# Altium schematic sheet connector.SchDoc
size A4
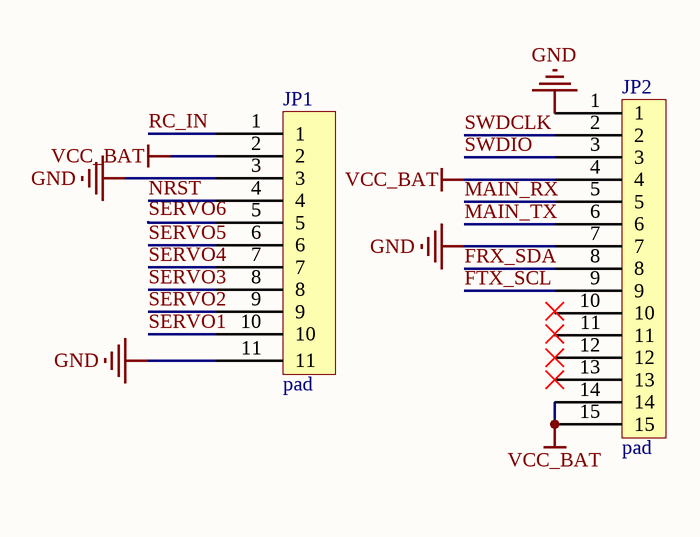
[diagram p0: connector.SchDoc]

## Parts
JP1  pad  [1.27*11]
JP2  pad  [1.27*15]

## Nets
GND: JP1.3 JP1.11 JP2.1 JP2.7
VCC_BAT: JP1.2 JP2.4 JP2.14 JP2.15
FRX_SDA: JP2.8
FTX_SCL: JP2.9
MAIN_RX: JP2.5
MAIN_TX: JP2.6
NRST: JP1.4
RC_IN: JP1.1
SERVO1: JP1.10
SERVO2: JP1.9
SERVO3: JP1.8
SERVO4: JP1.7
SERVO5: JP1.6
SERVO6: JP1.5
SWDCLK: JP2.2
SWDIO: JP2.3

Not connected (* = marked no-connect by the designer): JP2 10 11 12* 13*

## Library data of the parts
JP1 = 1.27*11: 11pin pad
JP2 = 1.27*15: 15pin pad